# Altium schematic sheet MCU.SchDoc
size 279 x 215 mm; SheetNumber: 5; SheetTotal: 6; SPICEModelCacheLZXJEGGY: <root> / <DocumentId>LZXJEGGY</DocumentId> / <CacheFrame Number="0"> / <Model Name="cap" Kind="MDL"> / <Text>*Default semiconductor capacitor / .MODEL CAP C()</Text> / </Model> / </CacheFrame> / </root>
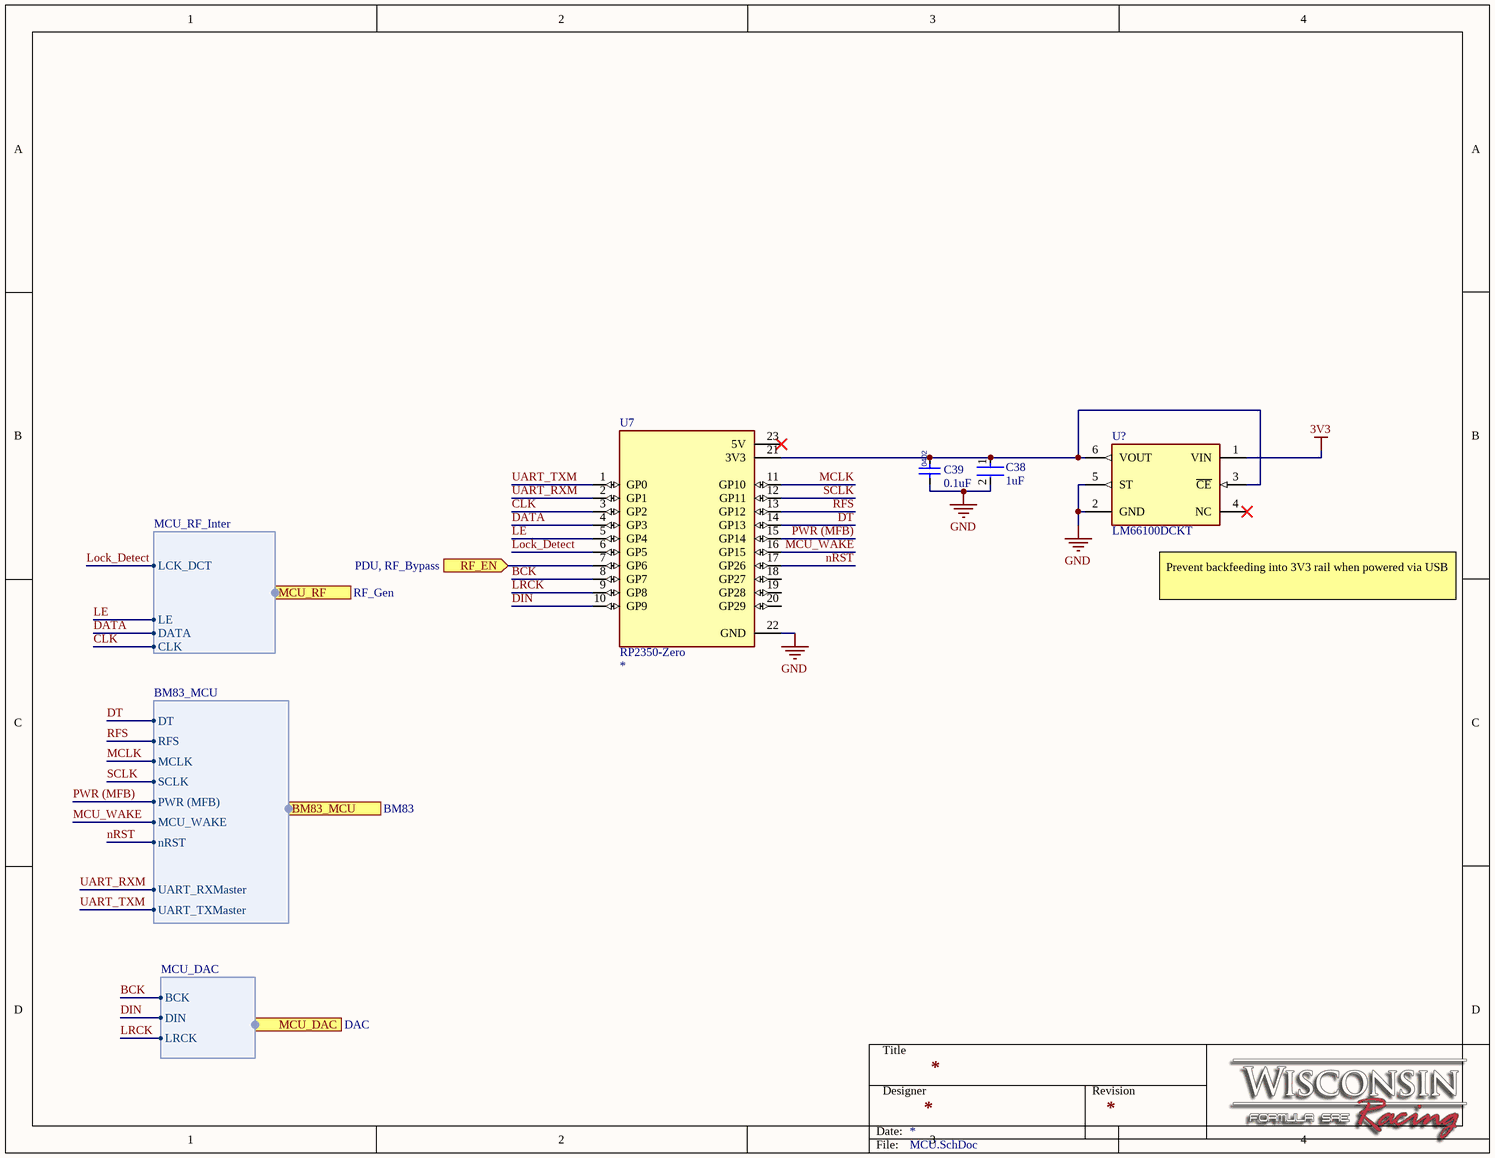
[diagram p0: MCU.SchDoc]

## Parts
C38  1uF  [FP-GRM155-0_1-IPC_C]
C39  0.1uF  [FP-CC0402-IPC_B]
U7  RP2350-Zero  [MODULE_RP2040-ZERO]
U?  LM66100DCKT  [FP-DCK0006A-IPC_C]

## Ports
BM83_MCU (harness BM83_MCU, see BM83), MCU_DAC (harness MCU_DAC, see DAC), MCU_RF (harness MCU_RF_Inter, see RF_Gen), RF_EN (in, see PDU, RF_Bypass)

## Harnesses
BM83_MCU: MCLK, MCU_WAKE, SCLK, PWR (MFB), RFS, DT, nRST, UART_TXMaster, UART_RXMaster
MCU_RF_Inter: LCK_DCT, LE, DATA, CLK
MCU_DAC: BCK, DIN, LRCK

## Nets
3V3: U?.1(VIN)
GND: C38.2 C39.1 U7.22(GND) U?.2(GND) U?.5(ST)
BCK: U7.8(GP7) ; port MCU_DAC.BCK
CLK: U7.3(GP2) ; port MCU_RF.CLK
DATA: U7.4(GP3) ; port MCU_RF.DATA
DIN: U7.10(GP9) ; port MCU_DAC.DIN
DT: U7.14(GP13) ; port BM83_MCU.DT
LE: U7.5(GP4) ; port MCU_RF.LE
Lock_Detect: U7.6(GP5) ; port MCU_RF.LCK_DCT
LRCK: U7.9(GP8) ; port MCU_DAC.LRCK
MCLK: U7.11(GP10) ; port BM83_MCU.MCLK
MCU_WAKE: U7.16(GP15) ; port BM83_MCU.MCU_WAKE
nRST: U7.17(GP26) ; port BM83_MCU.nRST
PWR (MFB): U7.15(GP14) ; port BM83_MCU.PWR (MFB)
RF_EN: U7.7(GP6) ; port RF_EN
RFS: U7.13(GP12) ; port BM83_MCU.RFS
SCLK: U7.12(GP11) ; port BM83_MCU.SCLK
UART_RXM: U7.2(GP1) ; port BM83_MCU.UART_RXMaster
UART_TXM: U7.1(GP0) ; port BM83_MCU.UART_TXMaster
NetC38_1: C38.1 C39.2 U7.21(3V3) U?.3(~{CE}) U?.6(VOUT)

Not connected (* = marked no-connect by the designer): U7 18(GP27) 19(GP28) 20(GP29) 23(5V)*; U? 4(NC)*

## Notes on the sheet
- (near U?) Prevent backfeeding into 3V3 rail when powered via USB
- Title
- Designer
- Revision
- Date:
- File:
- (in symbol CMP-Cap-00006-1) 0402

## Library data of the parts
C38 = CMP-06035-028020-1: Chip Multilayer Ceramic Capacitors for General Purpose, 0402, 1.0uF, X7R, 15%, 10%, 10V / GRM155Z71A105KE01D
C39 = CMP-Cap-00006-1: Ceramic Capacitor, Multilayer, Ceramic, 16V, 10% +Tol, 10% -Tol, X7R, 15% TC, 0.1uF, Surface Mount, 0402; Dielectric: XR7; Capacitance: 100nF; Tolerance: 10%; Voltage Rating: 16V
U7 = CMP-202-000000-1: Low-Cost, High-Performance Pico-Like MCU Board Based On Raspberry Pi Microcontroller RP2040; MF: Waveshare Electronics; Component Type: Standard; Source: RP2040-ZERO.SchLib; SnapEDA_Link: https://www.snapeda.com/parts/RP2040-ZERO/Waveshare+Electronics/view-part/?ref=snap; Value: *; Package: Package; Design Item ID: RP2040-ZERO; Check_prices: https://www.snapeda.com/parts/RP2040-ZERO/Waveshare+Electronics/view-part/?ref=eda; Pin Count: 23; MP: RP2040-ZERO
U? = CMP-04910-000059-1: IC OR CTRLR IDEAL DIODE SC70-6